# Altium schematic sheet POWER.SchDoc
size 420 x 297 mm; SheetNumber: 7; PageSetup: Record=PageOptions|CenterHorizontal=False|CenterVertical=False|PrintScale=0.95|XCorrection=0.00|YCorrection=0.00|PrintKind=1|BorderSize=5000000|LeftOffset=0|BottomOffset=0|Orientation=1|PaperLength=1000|PaperWidth=1000|Scale=100|PaperSource=15|PrintQuality=600|MediaType=1|DitherType=10|PaperKind=A4|PrintScaleMode=1
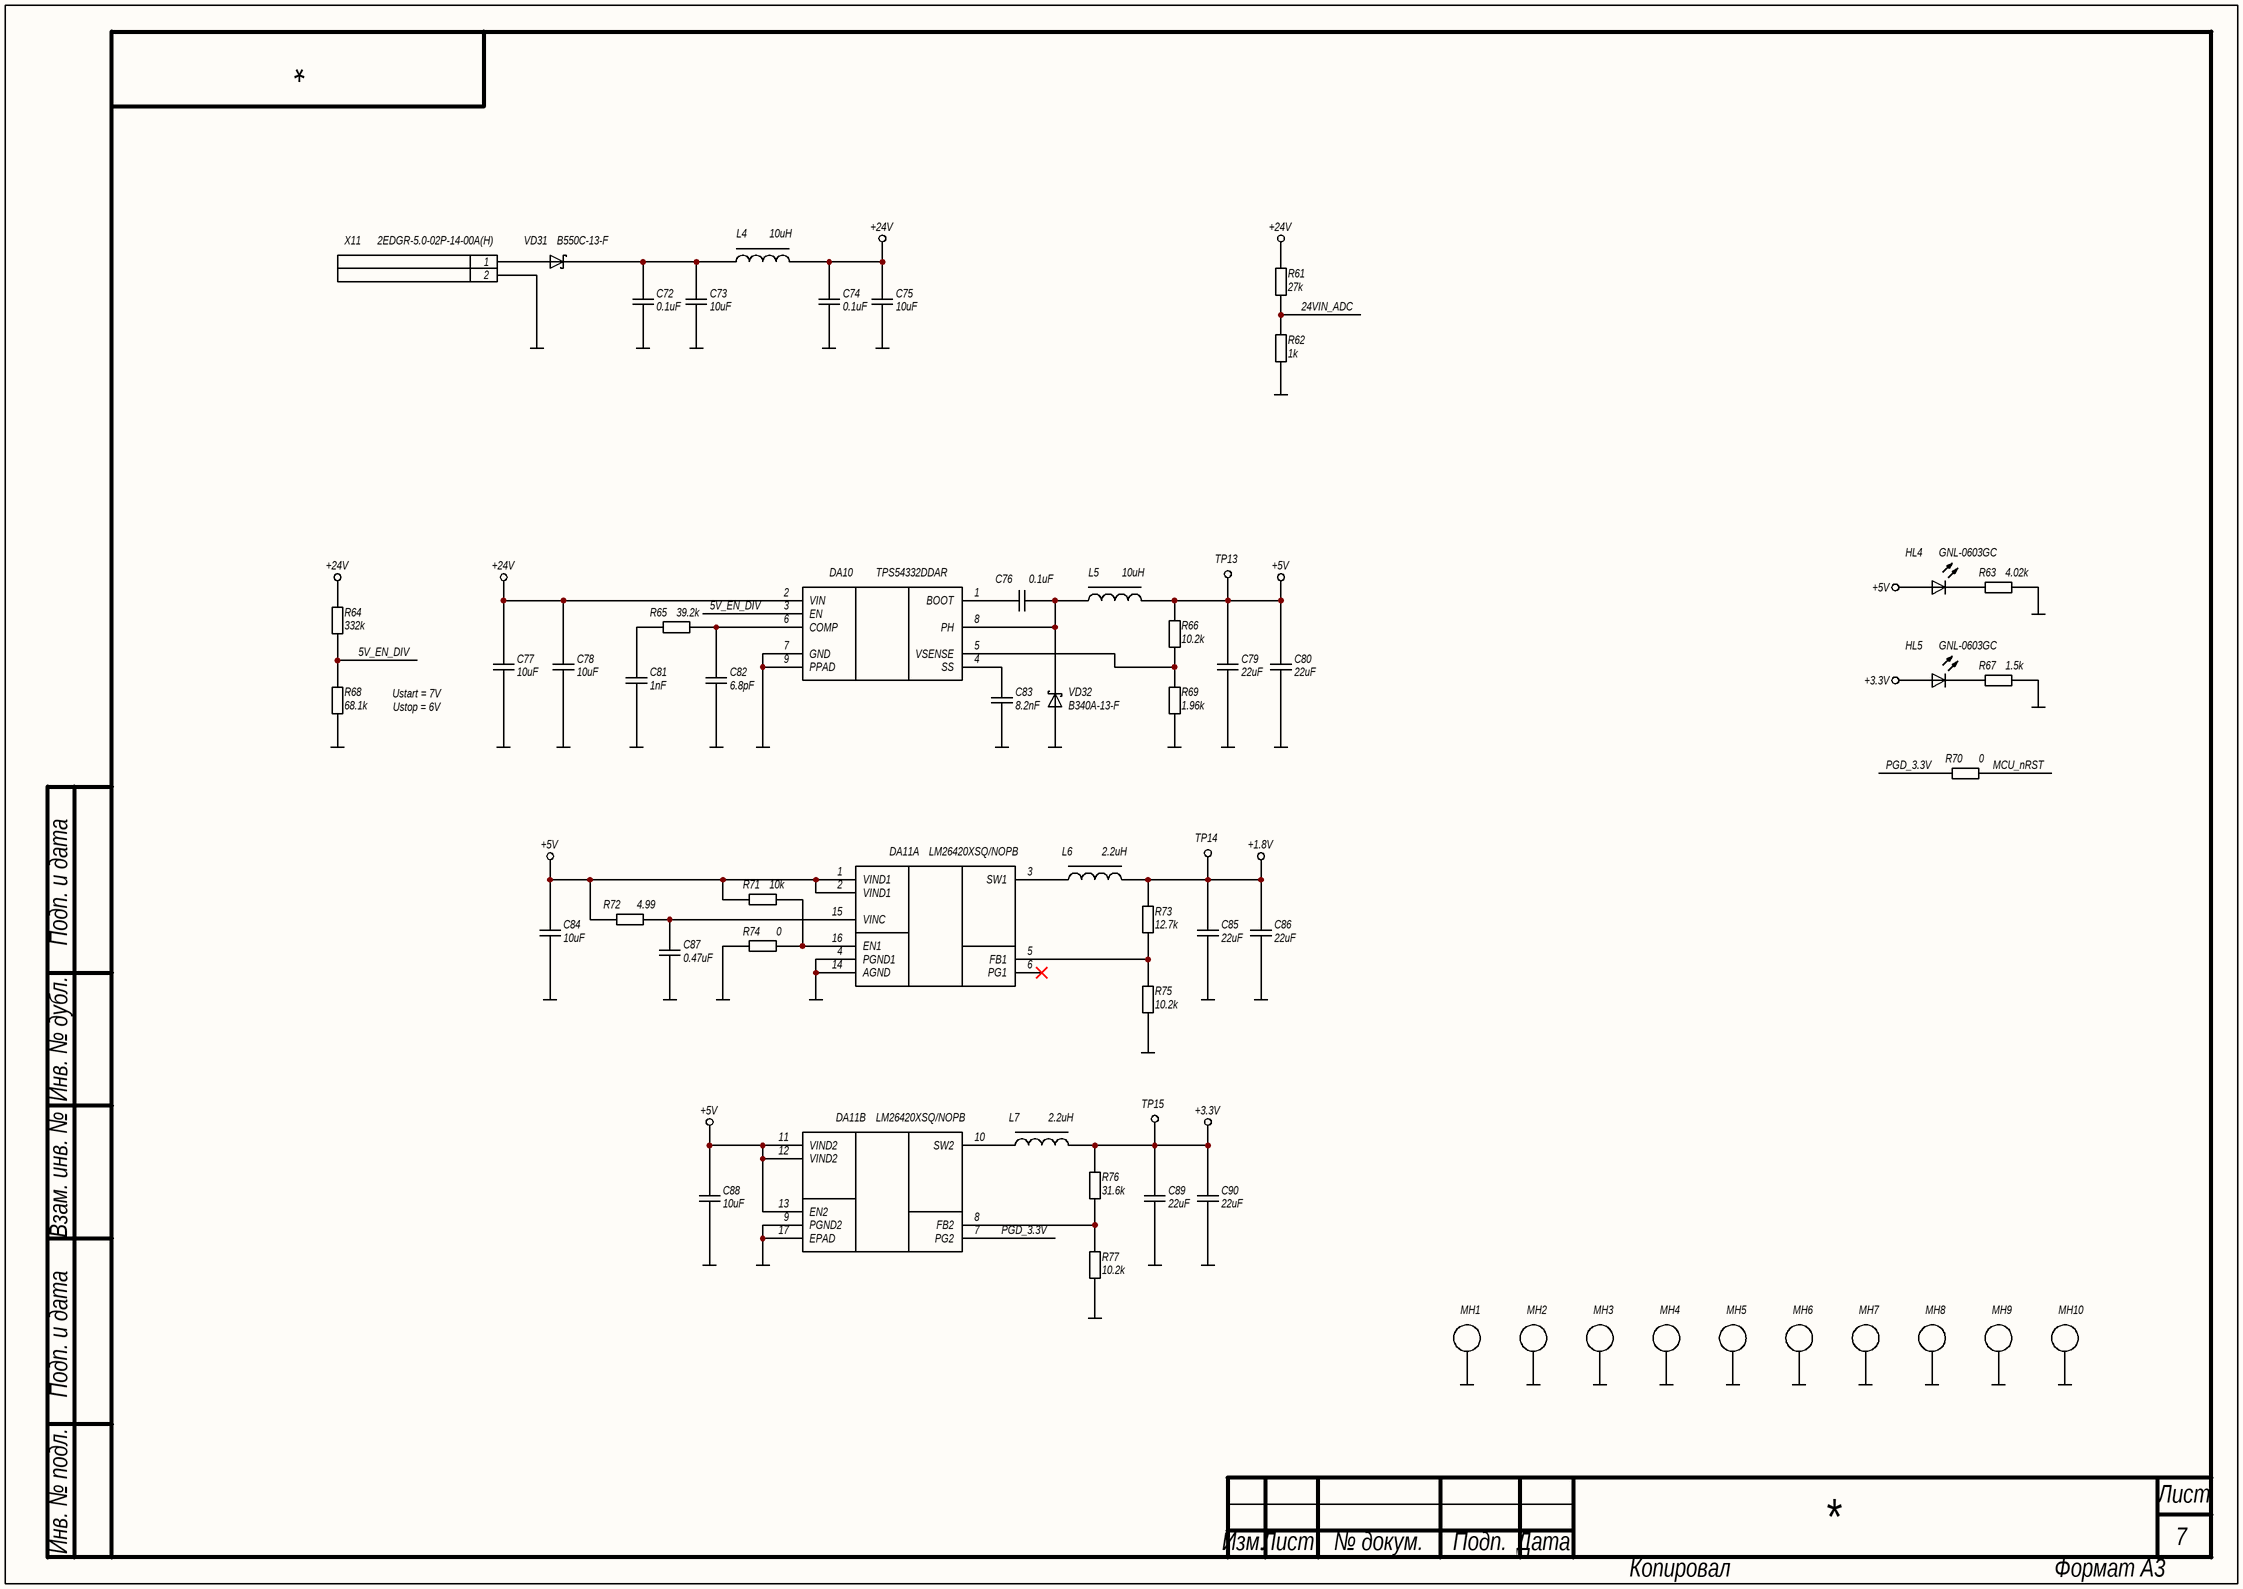
[diagram p0: POWER.SchDoc]

## Parts
C72  0.1uF  [C0805N]
C73  10uF  [C1206N]
C74  0.1uF  [C0805N]
C75  10uF  [C1206N]
C76  0.1uF  [C0603N]
C77  10uF  [C1206N]
C78  10uF  [C1206N]
C79  22uF  [C0805N]
C80  22uF  [C0805N]
C81  1nF  [C0603N]
C82  6.8pF  [C0603N]
C83  8.2nF  [C0603N]
C84  10uF  [C0805N]
C85  22uF  [C0805N]
C86  22uF  [C0805N]
C87  0.47uF  [C0603N]
C88  10uF  [C0805N]
C89  22uF  [C0805N]
C90  22uF  [C0805N]
DA10  TPS54332DDAR  [SOIC8-EP]
DA11  LM26420XSQ/NOPB  [RUM0016A]  (parts A,B of 2)
HL4  GNL-0603GC  [LED0603]
HL5  GNL-0603GC  [LED0603]
L4  10uH  [SRN8040]
L5  10uH  [SRN8040]
L6  2.2uH  [VLS3012HBX]
L7  2.2uH  [VLS3012HBX]
MH1  MNT_HOLE_PL  [MH_3.2_5.4_PLATED_VIA]  (value not drawn)  (no BOM)
MH2  MNT_HOLE_PL  [MH_3.2_5.4_PLATED_VIA]  (value not drawn)  (no BOM)
MH3  MNT_HOLE_PL  [MH_3.2_5.4_PLATED_VIA]  (value not drawn)  (no BOM)
MH4  MNT_HOLE_PL  [MH_3.2_5.4_PLATED_VIA]  (value not drawn)  (no BOM)
MH5  MNT_HOLE_PL  [MH_3.2_5.4_PLATED_VIA]  (value not drawn)  (no BOM)
MH6  MNT_HOLE_PL  [MH_3.2_5.4_PLATED_VIA]  (value not drawn)  (no BOM)
MH7  MNT_HOLE_PL  [MH_3.2_5.4_PLATED_VIA]  (value not drawn)  (no BOM)
MH8  MNT_HOLE_PL  [MH_3.2_5.4_PLATED_VIA]  (value not drawn)  (no BOM)
MH9  MNT_HOLE_PL  [MH_3.2_5.4_PLATED_VIA]  (value not drawn)  (no BOM)
MH10  MNT_HOLE_PL  [MH_3.2_5.4_PLATED_VIA]  (value not drawn)  (no BOM)
R61  27k  [R0603N]
R62  1k  [R0603N]
R63  4.02k  [R0603N]
R64  332k  [R0603N]
R65  39.2k  [R0603N]
R66  10.2k  [R0603N]
R67  1.5k  [R0603N]
R68  68.1k  [R0603N]
R69  1.96k  [R0603N]
R70  0  [R0603N]
R71  10k  [R0603N]
R72  4.99  [R0603N]
R73  12.7k  [R0603N]
R74  0  [R0603N]
R75  10.2k  [R0603N]
R76  31.6k  [R0603N]
R77  10.2k  [R0603N]
TP13  TEST_POINT  [TP_RPAD_0.8MM]  (value not drawn)  (no BOM)
TP14  TEST_POINT  [TP_RPAD_0.8MM]  (value not drawn)  (no BOM)
TP15  TEST_POINT  [TP_RPAD_0.8MM]  (value not drawn)  (no BOM)
VD31  B550C-13-F  [SMC]
VD32  B340A-13-F  [SMA]
X11  2EDGR-5.0-02P-14-00A(H)  [2EDGR-5.0-02P-14-00A(H)]

## Nets
+1.8V: C85.2 C86.2 L6.2 R73.1 TP14.1
+3.3V: C89.2 C90.2 HL5.2(A) L7.2 R76.1 TP15.1
+5V: C79.2 C80.2 C84.2 C88.2 DA11.1(VIND1) DA11.2(VIND1) DA11.11(VIND2) DA11.12(VIND2) DA11.13(EN2) HL4.2(A) L5.2 R66.1 R71.2 R72.2 TP13.1
+24V: C74.2 C75.2 C77.2 C78.2 DA10.2(VIN) L4.2 R61.2 R64.1
GND: C72.1 C73.1 C74.1 C75.1 C77.1 C78.1 C79.1 C80.1 C81.1 C82.1 C83.1 C84.1 C85.1 C86.1 C87.1 C88.1 C89.1 C90.1 DA10.7(GND) DA10.9(PPAD) DA11.4(PGND1) DA11.9(PGND2) DA11.14(AGND) DA11.17(EPAD) MH1.1 MH2.1 MH3.1 MH4.1 MH5.1 MH6.1 MH7.1 MH8.1 MH9.1 MH10.1 R62.1 R63.1 R67.1 R68.2 R69.2 R74.2 R75.2 R77.2 VD32.2(A) X11.2
5V_EN_DIV: DA10.3(EN) R64.2 R68.1
24VIN_ADC: R61.1 R62.2
MCU_nRST: R70.2
PGD_3.3V: DA11.7(PG2) R70.1
NetC72_2: C72.2 C73.2 L4.1 VD31.1(K)
NetC76_1: C76.1 DA10.8(PH) L5.1 VD32.1(K)
NetC76_2: C76.2 DA10.1(BOOT)
NetC81_2: C81.2 R65.2
NetC82_2: C82.2 DA10.6(COMP) R65.1
NetC83_2: C83.2 DA10.4(SS)
NetC87_2: C87.2 DA11.15(VINC) R72.1
NetDA10_5: DA10.5(VSENSE) R66.2 R69.1
NetDA11_3: DA11.3(SW1) L6.1
NetDA11_5: DA11.5(FB1) R73.2 R75.1
NetDA11_8: DA11.8(FB2) R76.2 R77.1
NetDA11_10: DA11.10(SW2) L7.1
NetDA11_16: DA11.16(EN1) R71.1 R74.1
NetHL4_1: HL4.1(K) R63.2
NetHL5_1: HL5.1(K) R67.2
NetVD31_2: VD31.2(A) X11.1

Not connected (* = marked no-connect by the designer): DA11 6(PG1)*

## Notes on the sheet
- Ustart = 7V
- Ustop = 6V
- Подп. и дата
- Инв. № дубл.
- Взам. инв. №
- Инв. № подл.
- Лист
- Изм.
- № докум.
- Подп.
- Дата
- Копировал
- Формат А3

## Library data of the parts
C72 C74 = CL21B104KCFNNNE: Конденсатор; Точность: 10%; Напряжение: 100V; Диэлектрик: X7R; Производитель: Samsung Electro-Mechanics; Описание: 0.1 µF ±10% 100V Ceramic Capacitor X7R 0805 (2012 Metric); Корпус: 0805 (2012 Metric); Температурный диапазон: -55°C ~ 125°C; Вид монтажа: SMD; Артикул: CL21B104KCFNNNE; Номинал: 0.1uF; Строка для документации: https://mm.digikey.com/Volume0/opasdata/d220001/medias/docus/893/CL21B104KCFNNNE_Spec.pdf; Тип элемента: Конденсатор
C73 C75 C77 C78 = CL31B106KBHNNNE: Конденсатор; Точность: 10%; Напряжение: 50V; Диэлектрик: X7R; Производитель: Samsung Electro-Mechanics; Описание: 10 µF ±10% 50V Ceramic Capacitor X7R 1206 (3216 Metric); Корпус: 1206 (3216 Metric); Температурный диапазон: -55°C ~ 125°C; Вид монтажа: SMD; Артикул: CL31B106KBHNNNE; Номинал: 10uF; Строка для документации: https://mm.digikey.com/Volume0/opasdata/d220001/medias/docus/41/CL31B106KBHNNNE_Spec.pdf; Тип элемента: Конденсатор
C76 = CL10B104KB8NNNC: Конденсатор; Точность: 10%; Напряжение: 50V; Диэлектрик: X7R; Производитель: Samsung Electro-Mechanics; Описание: 0.1 µF ±10% 50V Ceramic Capacitor X7R 0603 (1608 Metric); Корпус: 0603 (1608 Metric); Температурный диапазон: -55°C ~ 125°C; Вид монтажа: SMD; Артикул: CL10B104KB8NNNC; Номинал: 0.1uF; Строка для документации: https://mm.digikey.com/Volume0/opasdata/d220001/medias/docus/609/CL10B104KB8NNNC_Spec.pdf; Тип элемента: Конденсатор
C79 C80 C85 C86 C89 C90 = CL21A226MOCLRNC: Конденсатор; Точность: 20%; Напряжение: 16V; Диэлектрик: X5R; Производитель: Samsung Electro-Mechanics; Описание: 22 µF ±20% 16V Ceramic Capacitor X5R 0805 (2012 Metric); Корпус: 0805 (2012 Metric); Температурный диапазон: -55°C ~ 85°C; Вид монтажа: SMD; Артикул: CL21A226MOCLRNC; Номинал: 22uF; Строка для документации: https://mm.digikey.com/Volume0/opasdata/d220001/medias/docus/43/CL21A226MOCLRNC_Spec.pdf; Тип элемента: Конденсатор
C81 = CL10B102KC8NNNC: Конденсатор; Точность: 10%; Напряжение: 100V; Диэлектрик: X7R; Производитель: Samsung Electro-Mechanics; Описание: 1000 pF ±10% 100V Ceramic Capacitor X7R 0603 (1608 Metric); Корпус: 0603 (1608 Metric); Температурный диапазон: -55°C ~ 125°C; Вид монтажа: SMD; Артикул: CL10B102KC8NNNC; Номинал: 1nF; Строка для документации: https://mm.digikey.com/Volume0/opasdata/d220001/medias/docus/1136/CL10B102KC8NNNC_Spec.pdf; Тип элемента: Конденсатор
C82 = CC0603CRNPO9BN6R8: Конденсатор; Точность: ±0.25pF; Напряжение: 50V; Диэлектрик: NP0; Производитель: YAGEO; Описание: 6.8 pF ±0.25pF 50V Ceramic Capacitor C0G, NP0 0603 (1608 Metric); Корпус: 0603 (1608 Metric); Температурный диапазон: -55°C ~ 125°C; Вид монтажа: SMD; Артикул: CC0603CRNPO9BN6R8; Номинал: 6.8pF; Строка для документации: https://www.yageo.com/upload/media/product/productsearch/datasheet/mlcc/UPY-GP_NP0_16V-to-50V_18.pdf; Тип элемента: Конденсатор
C83 = CC0603KRX7R9BB822: Конденсатор; Точность: 10%; Напряжение: 50V; Диэлектрик: X7R; Производитель: YAGEO; Описание: 8200 pF ±10% 50V Ceramic Capacitor X7R 0603 (1608 Metric); Корпус: 0603 (1608 Metric); Температурный диапазон: -55°C ~ 125°C; Вид монтажа: SMD; Артикул: CC0603KRX7R9BB822; Номинал: 8.2nF; Строка для документации: https://www.yageo.com/upload/media/product/productsearch/datasheet/mlcc/UPY-GPHC_X7R_6.3V-to-250V_23.pdf; Тип элемента: Конденсатор
C84 C88 = CL21A106KAYNNNE: Конденсатор; Точность: 10%; Напряжение: 25V; Диэлектрик: X5R; Производитель: Samsung Electro-Mechanics; Описание: 10 µF ±10% 25V Ceramic Capacitor X5R 0805 (2012 Metric); Корпус: 0805 (2012 Metric); Температурный диапазон: -55°C ~ 85°C; Вид монтажа: SMD; Артикул: CL21A106KAYNNNE; Номинал: 10uF; Строка для документации: https://mm.digikey.com/Volume0/opasdata/d220001/medias/docus/5545/CL21A106KAYNNNE%20Spec.pdf; Тип элемента: Конденсатор
C87 = CL10B474KA8NNNC: Конденсатор; Точность: 10%; Напряжение: 25V; Диэлектрик: X7R; Производитель: Samsung Electro-Mechanics; Описание: 0.47 µF ±10% 25V Ceramic Capacitor X7R 0603 (1608 Metric); Корпус: 0603 (1608 Metric); Температурный диапазон: -55°C ~ 125°C; Вид монтажа: SMD; Артикул: CL10B474KA8NNNC; Номинал: 0.47uF; Строка для документации: https://mm.digikey.com/Volume0/opasdata/d220001/medias/docus/41/CL10B474KA8NNNC_Spec.pdf; Тип элемента: Конденсатор
DA10 = TPS54332DDAR: Микросхема понижающего преобразователя; Производитель: Texas Instruments; Описание: Buck Switching Regulator IC Positive Adjustable 0.8V 1 Output 3.5A 8-PowerSOIC (0.154", 3.90mm Width); Корпус: 8-PowerSOIC (0.154", 3.90mm Width); Температурный диапазон: -40°C ~ 150°C (TJ); Вид монтажа: SMD; Артикул: TPS54332DDAR; Строка для документации: https://www.ti.com/lit/ds/symlink/tps54332.pdf; Тип элемента: Микросхема
DA11 = LM26420XSQ/NOPB: Производитель: Texas Instruments; Описание: Buck Switching Regulator IC Positive Adjustable 0.8V 2 Output 2A 16-WQFN Exposed Pad; Корпус: 16-WQFN (4x4); Температурный диапазон: -40°C ~ 125°C (TJ); Вид монтажа: SMD; Тип элемента: Микросхема; Артикул: LM26420XSQ/NOPB; Строка для документации: https://www.ti.com/lit/ds/symlink/lm26420.pdf
HL4 HL5 = GNL-0603GC: Светодиод; Прямой ток: 20mA; Напряжение: 2V; Яркость: 12mcd; Цвет: Зеленый; Длина волны: 567nm; Производитель: G-nor Electronics; Описание: Green 567nm LED Indication - Discrete 2V 0603 (1608 Metric); Корпус: 0603 (1608 Metric); Температурный диапазон: -40°C ~ 80°C; Вид монтажа: SMD; Тип элемента: Диод светоизлучающий; Артикул: GNL-0603GC; Строка для документации: https://www.g-nor.com/Uploads/Ed/file/20210517/1621223120713818.doc
L4 L5 = SRN8040-100M: Дроссель с магнитопроводом; Точность: 20%; Ток номинальный: 3.1A; Ток насыщения: 3.4A; Сопротивление: 50m; Производитель: Bourns Inc.; Описание: 15 µH Semi-Shielded Drum Core, Wirewound Inductor 2.4 A 70mOhm Max Nonstandard; Корпус: 8.00mm x 8.00mm; Температурный диапазон: -40°C ~ 125°C; Вид монтажа: SMD; Артикул: SRN8040-100M; Номинал: 10uH; Строка для документации: https://www.bourns.com/docs/Product-Datasheets/SRN8040.pdf; Тип элемента: Дроссель
L6 L7 = VLS3012HBX-2R2M: Дроссель с магнитопроводом; Точность: 20%; Ток номинальный: 3.15A; Ток насыщения: 3.35A; Сопротивление: 106m; Производитель: TDK Corporation; Описание: 2.2 µH Shielded Drum Core, Wirewound Inductor 3.15 A 106mOhm Max Nonstandard; Корпус: 3.00mm x 3.00mm; Температурный диапазон: -40°C ~ 105°C; Вид монтажа: SMD; Артикул: VLS3012HBX-2R2M; Номинал: 2.2uH; Строка для документации: https://product.tdk.com/en/system/files?file=dam/doc/product/inductor/inductor/smd/catalog/inductor_commercial_power_vls3012hbx_en.pdf; Тип элемента: Дроссель
MH1-MH10 = Mounting Hole, 3.2mm/5.4mm, plated, with via stiching: Монтажное отверстие, металлизированное; Тип элемента: Механический; Артикул: Mounting Hole, 3.2mm/5.4mm, plated, with via stiching; Описание: Mounting Hole, 3.2mm/5.4mm , plated, with via stiching; Тип: Mounting Hole
R61 = RC0603FR-0727KL: Резистор; Точность: 1%; ТКС: ±100ppm/°C; Напряжение: 75V; Производитель: YAGEO; Описание: 27 kOhms Jumper Chip Resistor 0603 (1608 Metric) Moisture Resistant Thick Film; Корпус: 0603 (1608 Metric); Температурный диапазон: -55°C ~ 155°C; Вид монтажа: SMD; Артикул: RC0603FR-0727KL; Номинал: 27k; Строка для документации: https://www.yageo.com/upload/media/product/app/datasheet/rchip/pyu-rc_group_51_rohs_l.pdf; Тип элемента: Резистор
R62 = RC0603FR-071KL: Резистор; Точность: 1%; ТКС: ±100ppm/°C; Напряжение: 75V; Производитель: YAGEO; Описание: 1 kOhms ±1% 0.1W, 1/10W Chip Resistor 0603 (1608 Metric) Moisture Resistant Thick Film; Корпус: 0603 (1608 Metric); Температурный диапазон: -55°C ~ 155°C; Вид монтажа: SMD; Артикул: RC0603FR-071KL; Номинал: 1k; Строка для документации: https://www.yageo.com/upload/media/product/app/datasheet/rchip/pyu-rc_group_51_rohs_l.pdf; Тип элемента: Резистор
R63 = RC0603FR-074K02L: Резистор; Точность: 1%; ТКС: ±100ppm/°C; Напряжение: 75V; Производитель: YAGEO; Описание: 4.02 kOhms ±1% 0.1W, 1/10W Chip Resistor 0603 (1608 Metric) Moisture Resistant Thick Film; Корпус: 0603 (1608 Metric); Температурный диапазон: -55°C ~ 155°C; Вид монтажа: SMD; Артикул: RC0603FR-074K02L; Номинал: 4.02k; Строка для документации: https://www.yageo.com/upload/media/product/app/datasheet/rchip/pyu-rc_group_51_rohs_l.pdf; Тип элемента: Резистор
R64 = RC0603FR-07332KL: Резистор; Точность: 1%; ТКС: ±100ppm/°C; Напряжение: 75V; Производитель: YAGEO; Описание: 332 kOhms ±1% 0.1W, 1/10W Chip Resistor 0603 (1608 Metric) Moisture Resistant Thick Film; Корпус: 0603 (1608 Metric); Температурный диапазон: -55°C ~ 155°C; Вид монтажа: SMD; Артикул: RC0603FR-07332KL; Номинал: 332k; Строка для документации: https://www.yageo.com/upload/media/product/app/datasheet/rchip/pyu-rc_group_51_rohs_l.pdf; Тип элемента: Резистор
R65 = RC0603FR-0739K2L: Резистор; Точность: 1%; ТКС: ±100ppm/°C; Напряжение: 75V; Производитель: YAGEO; Описание: 39.2 kOhms ±1% 0.1W, 1/10W Chip Resistor 0603 (1608 Metric) Moisture Resistant Thick Film; Корпус: 0603 (1608 Metric); Температурный диапазон: -55°C ~ 155°C; Вид монтажа: SMD; Артикул: RC0603FR-0739K2L; Номинал: 39.2k; Строка для документации: https://www.yageo.com/upload/media/product/app/datasheet/rchip/pyu-rc_group_51_rohs_l.pdf; Тип элемента: Резистор
R66 R75 R77 = RC0603FR-0710K2L: Резистор; Точность: 1%; ТКС: ±100ppm/°C; Напряжение: 75V; Производитель: YAGEO; Описание: 10.2 kOhms ±1% 0.1W, 1/10W Chip Resistor 0603 (1608 Metric) Moisture Resistant Thick Film; Корпус: 0603 (1608 Metric); Температурный диапазон: -55°C ~ 155°C; Вид монтажа: SMD; Артикул: RC0603FR-0710K2L; Номинал: 10.2k; Строка для документации: https://www.yageo.com/upload/media/product/app/datasheet/rchip/pyu-rc_group_51_rohs_l.pdf; Тип элемента: Резистор
R67 = RC0603FR-071K5L: Резистор; Точность: 1%; ТКС: ±100ppm/°C; Напряжение: 75V; Производитель: YAGEO; Описание: 1.5 kOhms ±1% 0.1W, 1/10W Chip Resistor 0603 (1608 Metric) Moisture Resistant Thick Film; Корпус: 0603 (1608 Metric); Температурный диапазон: -55°C ~ 155°C; Вид монтажа: SMD; Артикул: RC0603FR-071K5L; Номинал: 1.5k; Строка для документации: https://www.yageo.com/upload/media/product/app/datasheet/rchip/pyu-rc_group_51_rohs_l.pdf; Тип элемента: Резистор
R68 = RC0603FR-0768K1L: Резистор; Точность: 1%; ТКС: ±100ppm/°C; Напряжение: 75V; Производитель: YAGEO; Описание: 68.1 kOhms ±1% 0.1W, 1/10W Chip Resistor 0603 (1608 Metric) Moisture Resistant Thick Film; Корпус: 0603 (1608 Metric); Температурный диапазон: -55°C ~ 155°C; Вид монтажа: SMD; Артикул: RC0603FR-0768K1L; Номинал: 68.1k; Строка для документации: https://www.yageo.com/upload/media/product/app/datasheet/rchip/pyu-rc_group_51_rohs_l.pdf; Тип элемента: Резистор
R69 = RC0603FR-071K96L: Резистор; Точность: 1%; ТКС: ±100ppm/°C; Напряжение: 75V; Производитель: YAGEO; Описание: 1.96 kOhms ±1% 0.1W, 1/10W Chip Resistor 0603 (1608 Metric) Moisture Resistant Thick Film; Корпус: 0603 (1608 Metric); Температурный диапазон: -55°C ~ 155°C; Вид монтажа: SMD; Артикул: RC0603FR-071K96L; Номинал: 1.96k; Строка для документации: https://www.yageo.com/upload/media/product/app/datasheet/rchip/pyu-rc_group_51_rohs_l.pdf; Тип элемента: Резистор
R70 R74 = RC0603FR-070RL: Резистор; Точность: 1%; ТКС: ±100ppm/°C; Напряжение: 75V; Производитель: YAGEO; Описание: 0 Ohms Jumper Chip Resistor 0603 (1608 Metric) Moisture Resistant Thick Film; Корпус: 0603 (1608 Metric); Температурный диапазон: -55°C ~ 155°C; Вид монтажа: SMD; Артикул: RC0603FR-070RL; Номинал: 0; Строка для документации: https://www.yageo.com/upload/media/product/app/datasheet/rchip/pyu-rc_group_51_rohs_l.pdf; Тип элемента: Резистор
R71 = RC0603FR-0710KL: Резистор; Точность: 1%; ТКС: ±100ppm/°C; Напряжение: 75V; Производитель: YAGEO; Описание: 10 kOhms ±1% 0.1W, 1/10W Chip Resistor 0603 (1608 Metric) Moisture Resistant Thick Film; Корпус: 0603 (1608 Metric); Температурный диапазон: -55°C ~ 155°C; Вид монтажа: SMD; Артикул: RC0603FR-0710KL; Номинал: 10k; Строка для документации: https://www.yageo.com/upload/media/product/app/datasheet/rchip/pyu-rc_group_51_rohs_l.pdf; Тип элемента: Резистор
R72 = RC0603FR-074R99L: Резистор; Точность: 1%; ТКС: ±100ppm/°C; Напряжение: 75V; Производитель: YAGEO; Описание: 4.99 Ohms ±1% 0.1W, 1/10W Chip Resistor 0603 (1608 Metric) Moisture Resistant Thick Film; Корпус: 0603 (1608 Metric); Температурный диапазон: -55°C ~ 155°C; Вид монтажа: SMD; Артикул: RC0603FR-074R99L; Номинал: 4.99; Строка для документации: https://www.yageo.com/upload/media/product/app/datasheet/rchip/pyu-rc_group_51_rohs_l.pdf; Тип элемента: Резистор
R73 = RC0603FR-0712K7L: Резистор; Точность: 1%; ТКС: ±100ppm/°C; Напряжение: 75V; Производитель: YAGEO; Описание: 12.7 kOhms ±1% 0.1W, 1/10W Chip Resistor 0603 (1608 Metric) Moisture Resistant Thick Film; Корпус: 0603 (1608 Metric); Температурный диапазон: -55°C ~ 155°C; Вид монтажа: SMD; Артикул: RC0603FR-0712K7L; Номинал: 12.7k; Строка для документации: https://www.yageo.com/upload/media/product/app/datasheet/rchip/pyu-rc_group_51_rohs_l.pdf; Тип элемента: Резистор
R76 = RC0603FR-0731K6L: Резистор; Точность: 1%; ТКС: ±100ppm/°C; Напряжение: 75V; Производитель: YAGEO; Описание: 31.6 kOhms ±1% 0.1W, 1/10W Chip Resistor 0603 (1608 Metric) Moisture Resistant Thick Film; Корпус: 0603 (1608 Metric); Температурный диапазон: -55°C ~ 155°C; Вид монтажа: SMD; Артикул: RC0603FR-0731K6L; Номинал: 31.6k; Строка для документации: https://www.yageo.com/upload/media/product/app/datasheet/rchip/pyu-rc_group_51_rohs_l.pdf; Тип элемента: Резистор
TP13-TP15 = Test Point, Round Pad, 0.8mm diameter: Контрольная точка; Количество контактов: 1; Тип элемента: Разъем; Артикул: Test Point, Round Pad, 0.8mm diameter; Тип разъема: Test Point; Описание: Test Point, Round Pad, 0.8mm diameter
VD31 = B550C-13-F: Диод Шоттки; Прямой ток: 5A; Напряжение: 50V; Производитель: Diodes Incorporated; Описание: Diode 50 V 5A Surface Mount SMC; Корпус: DO-214AB, SMC; Температурный диапазон: -55°C ~ 150°C; Вид монтажа: SMD; Артикул: B550C-13-F; Тип: Schottky; Строка для документации: https://www.diodes.com/assets/Datasheets/B520C-B560C.pdf; Тип элемента: Диод
VD32 = B340A-13-F: Диод Шоттки; Прямой ток: 3A; Напряжение: 40V; Производитель: Diodes Incorporated; Описание: Diode 40 V 3A Surface Mount SMA; Корпус: DO-214AC, SMA; Температурный диапазон: -55°C ~ 150°C; Вид монтажа: SMD; Артикул: B340A-13-F; Тип: Schottky; Строка для документации: https://www.diodes.com/assets/Datasheets/ds30891.pdf; Тип элемента: Диод
X11 = 2EDGR-5.0-02P-14-00A(H): Разъем, 2 контакта; Тип разъема: Pluggable terminal block; Количество контактов: 2; Шаг контактов: 5mm; Ток: 20A; Напряжение: 320V; Производитель: Degson Electronics; Описание: Pluggable terminal block; 5.0mm; ways: 2; angled 90; socket; male; Температурный диапазон: -40°C ~ 105°C; Вид монтажа: Through Hole; Артикул: 2EDGR-5.0-02P-14-00A(H); Строка для документации: https://www.tme.eu/Document/aee9e19a2094185fa8ff38cbebedb2f3/2EDGR-5.0.pdf; Тип элемента: Разъем